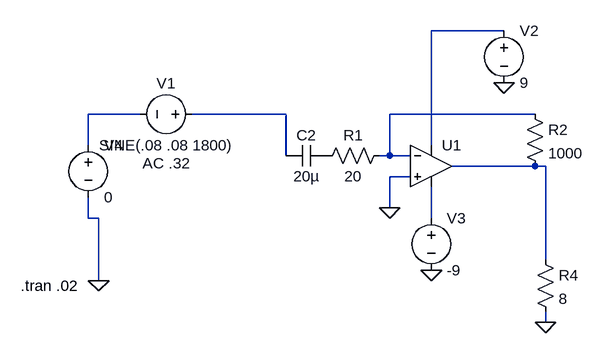
[diagram p0: schematic photodiode_speaker_fiesta.asc]
photodiode_speaker_fiesta.asc, the LTspice schematic file:
Version 4
SHEET 1 1532 680
WIRE 384 -352 272 -352
WIRE -176 -224 -256 -224
WIRE 48 -224 -96 -224
WIRE 432 -224 208 -224
WIRE -256 -176 -256 -224
WIRE 272 -176 272 -352
WIRE 48 -160 48 -224
WIRE 208 -160 208 -224
WIRE 208 -160 192 -160
WIRE 240 -160 208 -160
WIRE 432 -144 304 -144
WIRE 448 -144 432 -144
WIRE 240 -128 208 -128
WIRE 208 -80 208 -128
WIRE -256 -64 -256 -96
WIRE -240 -64 -256 -64
WIRE 272 -64 272 -112
WIRE 448 0 448 -144
WIRE -240 32 -240 -64
WIRE 448 96 448 80
FLAG 208 -80 0
FLAG 272 16 0
FLAG 384 -272 0
FLAG -240 32 0
FLAG 448 96 0
SYMBOL voltage -80 -224 R90
WINDOW 0 -32 56 VBottom 2
WINDOW 3 32 56 VTop 2
WINDOW 123 60 56 VTop 2
WINDOW 39 0 0 Left 2
SYMATTR InstName V1
SYMATTR Value SINE(.08 .08 1800)
SYMATTR Value2 AC .32
SYMBOL cap 48 -144 R270
WINDOW 0 32 32 VTop 2
WINDOW 3 0 32 VBottom 2
SYMATTR InstName C2
SYMATTR Value 20µ
SYMBOL res 96 -144 R270
WINDOW 0 32 56 VTop 2
WINDOW 3 0 56 VBottom 2
SYMATTR InstName R1
SYMATTR Value 20
SYMBOL Opamps\\UniversalOpamp2 272 -144 R0
SYMATTR InstName U1
SYMBOL res 416 -240 R0
SYMATTR InstName R2
SYMATTR Value 1000
SYMBOL voltage 384 -368 R0
WINDOW 123 0 0 Left 2
WINDOW 39 0 0 Left 2
SYMATTR InstName V2
SYMATTR Value 9
SYMBOL voltage 272 -80 R0
WINDOW 123 0 0 Left 2
WINDOW 39 0 0 Left 2
SYMATTR InstName V3
SYMATTR Value -9
SYMBOL voltage -256 -192 R0
WINDOW 123 0 0 Left 2
WINDOW 39 0 0 Left 2
SYMATTR InstName V4
SYMATTR Value 0
SYMBOL res 432 -16 R0
SYMATTR InstName R4
SYMATTR Value 8
TEXT -360 40 Left 2 !.tran .02

The netlist it stands for:
* photodiode_speaker_fiesta.asc
V1 N003 N002 SINE(.08 .08 1800) AC .32
C2 N003 P001 20µ
R1 P001 N004 20
XU1 0 N004 N001 N006 N005 level.2 Avol=1Meg GBW=10Meg Slew=10Meg ilimit=25m rail=0 Vos=0 phimargin=45 en=0 enk=0 in=0 ink=0 Rin=500Meg  ; pins IN+ IN- V+ V- OUT
R2 N004 N005 1000
V2 N001 0 9
V3 N006 0 -9
V4 N002 0 0
R4 N005 0 8
.tran .02
.lib UniversalOpamps2.sub
.backanno
.end